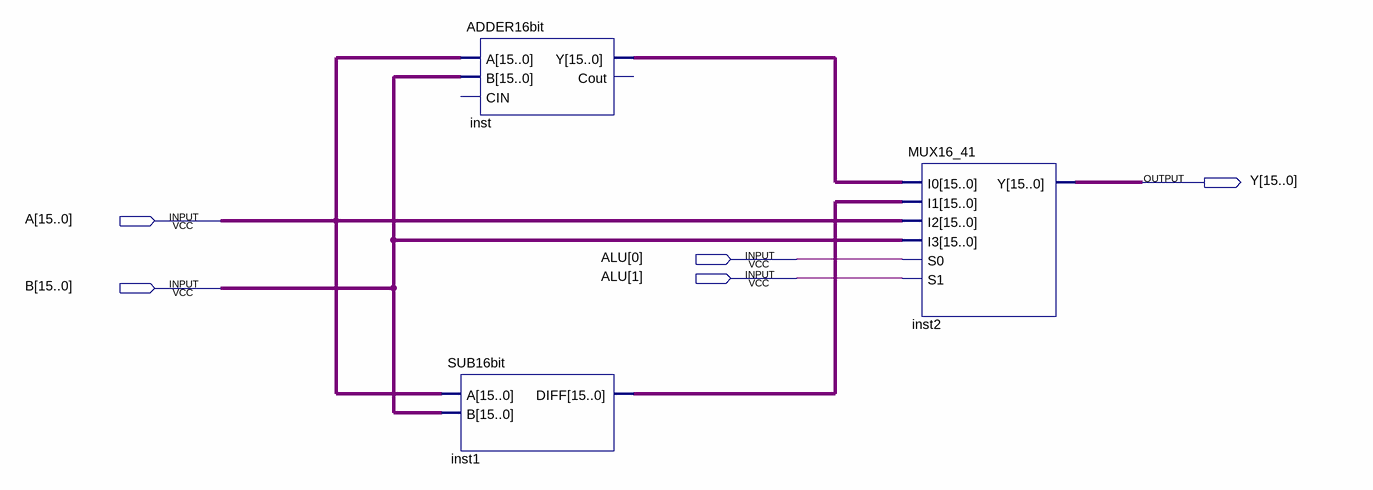
[diagram p0: schematic sheet]
// Quartus schematic ALU.bdf as structural Verilog: 3 symbols, 5 pins
module ALU (
  input  [15:0] A,
  input  [1:0] ALU,
  input  [15:0] B,
  output [15:0] Y
);

  wire [15:0] inst1_diff, inst_y;

  ADDER16bit inst (.A(A), .B(B), .Y(inst_y));  // open: CIN, Cout
  SUB16bit inst1 (.A(A), .B(B), .DIFF(inst1_diff));
  MUX16_41 inst2 (.I0(inst_y), .I1(inst1_diff), .I2(A), .I3(B), .S0(ALU[0]), .S1(ALU[1]), .Y(Y));
endmodule
